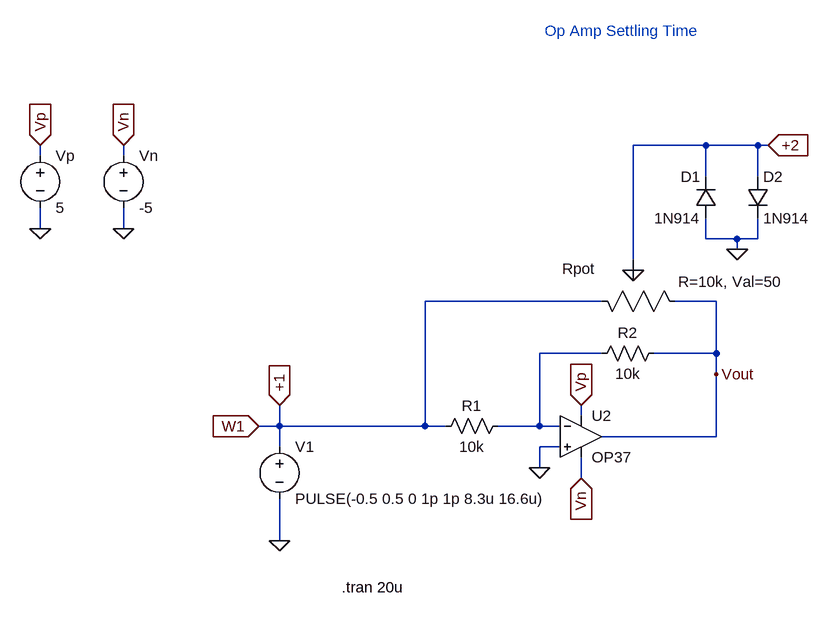
[diagram p0: schematic opamp_settling_time_ltspice.asc]
opamp_settling_time_ltspice.asc, the LTspice schematic file:
Version 4
SHEET 1 1812 680
WIRE 304 -288 192 -288
WIRE 384 -288 304 -288
WIRE 400 -288 384 -288
WIRE -720 -272 -720 -288
WIRE -592 -272 -592 -288
WIRE 304 -240 304 -288
WIRE 384 -240 384 -288
WIRE -720 -160 -720 -192
WIRE -592 -160 -592 -192
WIRE 304 -144 304 -176
WIRE 352 -144 304 -144
WIRE 384 -144 384 -176
WIRE 384 -144 352 -144
WIRE 352 -128 352 -144
WIRE 192 -112 192 -288
WIRE 144 -48 -128 -48
WIRE 320 -48 256 -48
WIRE 144 32 48 32
WIRE 320 32 320 -48
WIRE 320 32 224 32
WIRE 320 64 320 32
WIRE 112 128 112 112
WIRE -352 144 -352 112
WIRE -352 144 -384 144
WIRE -128 144 -128 -48
WIRE -128 144 -352 144
WIRE -96 144 -128 144
WIRE 48 144 48 32
WIRE 48 144 -16 144
WIRE 80 144 48 144
WIRE 320 160 320 64
WIRE 320 160 144 160
WIRE -352 176 -352 144
WIRE 80 176 48 176
WIRE 48 208 48 176
WIRE 112 224 112 192
WIRE -352 320 -352 256
FLAG -720 -160 0
FLAG -592 -160 0
FLAG -352 320 0
FLAG 352 -128 0
FLAG 48 208 0
FLAG -720 -288 Vp
IOPIN -720 -288 In
FLAG 112 224 Vn
IOPIN 112 224 In
FLAG -384 144 W1
IOPIN -384 144 In
FLAG -352 112 +1
IOPIN -352 112 In
FLAG 400 -288 +2
IOPIN 400 -288 In
FLAG 320 64 Vout
FLAG -592 -288 Vn
IOPIN -592 -288 In
FLAG 112 112 Vp
IOPIN 112 112 In
SYMBOL voltage -720 -288 R0
WINDOW 123 0 0 Left 0
WINDOW 39 0 0 Left 0
SYMATTR InstName Vp
SYMATTR Value 5
SYMBOL voltage -592 -288 R0
WINDOW 123 0 0 Left 0
WINDOW 39 0 0 Left 0
SYMATTR InstName Vn
SYMATTR Value -5
SYMBOL res 0 128 R90
WINDOW 0 0 56 VBottom 2
WINDOW 3 32 56 VTop 2
SYMATTR InstName R1
SYMATTR Value 10k
SYMBOL voltage -352 160 R0
WINDOW 123 0 0 Left 0
WINDOW 39 0 0 Left 0
SYMATTR InstName V1
SYMATTR Value PULSE(-0.5 0.5 0 1p 1p 8.3u 16.6u)
SYMBOL res 240 16 R90
WINDOW 0 0 56 VBottom 2
WINDOW 3 32 56 VTop 2
SYMATTR InstName R2
SYMATTR Value 10k
SYMBOL diode 368 -240 R0
SYMATTR InstName D2
SYMATTR Value 1N914
SYMBOL diode 320 -176 R180
WINDOW 0 24 64 Left 2
WINDOW 3 24 0 Left 2
SYMATTR InstName D1
SYMATTR Value 1N914
SYMBOL Opamps\\OP37 112 96 R0
SYMATTR InstName U2
SYMBOL potentiometer 160 -64 M90
WINDOW 0 -34 -26 VLeft 2
WINDOW 39 -14 261 VLeft 2
SYMATTR InstName Rpot
SYMATTR SpiceLine R=10k, Val=50
TEXT -256 392 Left 2 !.tran 20u
TEXT 56 -464 Left 2 ;Op Amp Settling Time

The netlist it stands for:
* opamp_settling_time_ltspice.asc
Vp Vp 0 5
Vn Vn 0 -5
R1 N001 +1 10k
V1 +1 0 PULSE(-0.5 0.5 0 1p 1p 8.3u 16.6u)
R2 Vout N001 10k
D2 +2 0 1N914
D1 0 +2 1N914
XU2 0 N001 Vp Vn Vout LT1037  ; OP37, pins In+ In- V+ V- OUT
XRpot +1 +2 Vout potentiometer R=10k, Val=50  ; pins 1 2 3
.model D D
.lib standard.dio
.tran 20u
* Op Amp Settling Time
.lib LTC.lib
.backanno
.end